# Altium project GolgiBot_V2.02_Cabos.PrjPcb
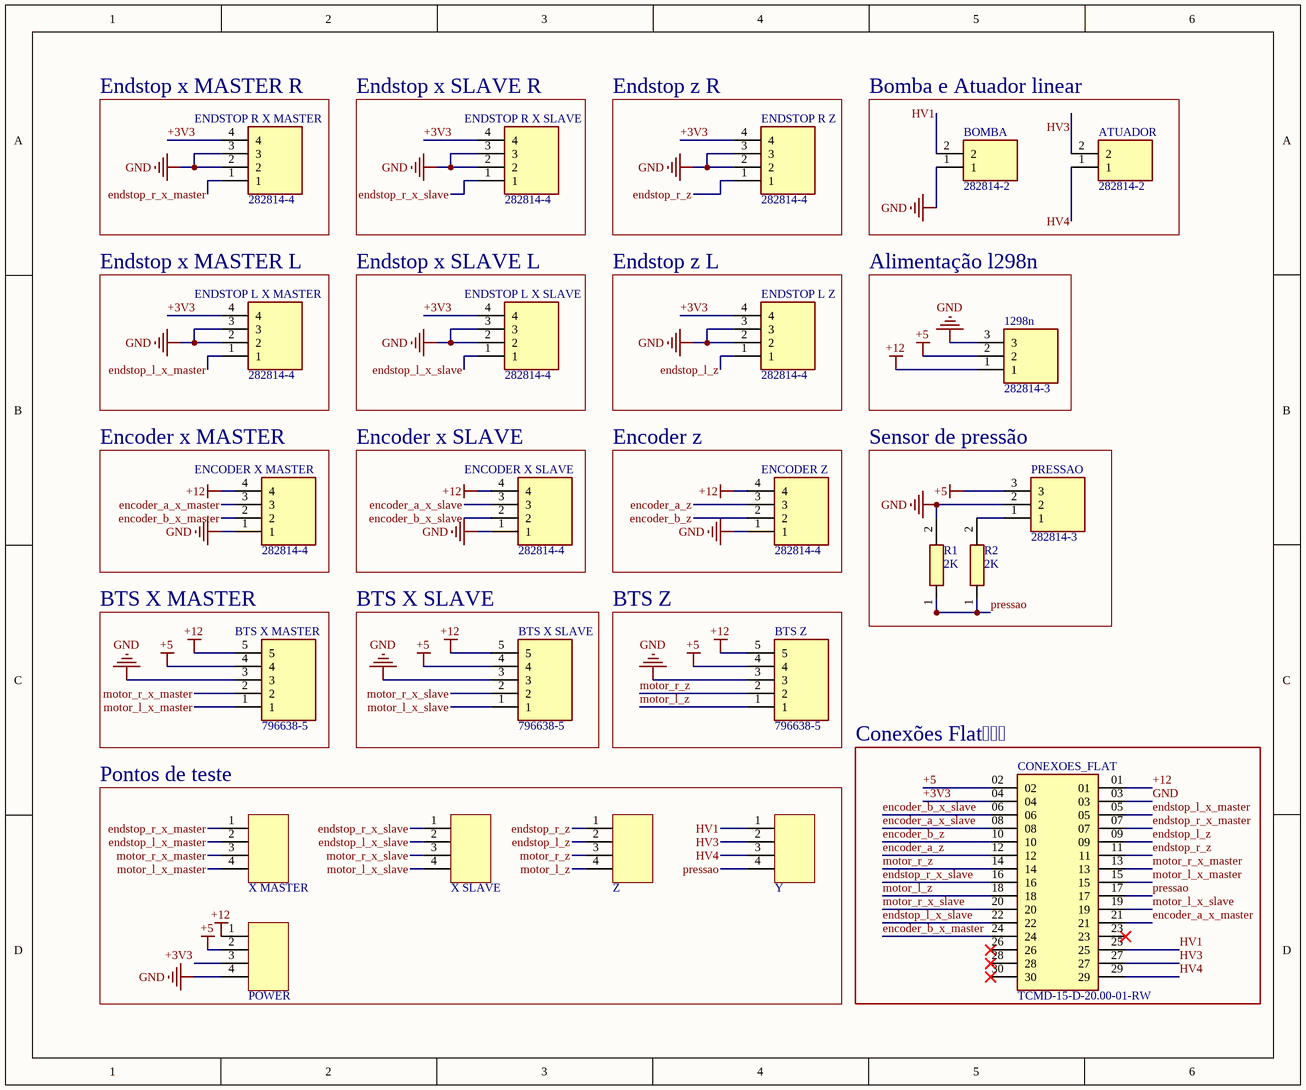
[diagram p0: GolgiBot_V2.02_Cabos.SchDoc]
1 sheet, 24 parts. Net scope: global (net labels, ports and power ports of the same name join across sheets).
Board file: GolgiBot_V2.02_Cabos.PcbDoc

## Sheet GolgiBot_V2.02_Cabos.SchDoc
size 243 x 203 mm; SheetNumber: 1; SheetTotal: 1

### Parts
1298n  282814-3  [TE_282814-3]
ATUADOR  282814-2  [TE_282814-2]
BOMBA  282814-2  [TE_282814-2]
BTS_X_MASTER  796638-5  [TE_796638-5]
BTS_X_SLAVE  796638-5  [TE_796638-5]
BTS_Z  796638-5  [TE_796638-5]
CONEXOES_FLAT  TCMD-15-D-20.00-01-RW  [SAMTEC_TCMD-15-D-20.00-01-RW]
ENCODER_X_MASTER  282814-4  [2828144]
ENCODER_X_SLAVE  282814-4  [2828144]
ENCODER_Z  282814-4  [2828144]
ENDSTOP_L_X_MASTER  282814-4  [2828144]
ENDSTOP_L_X_SLAVE  282814-4  [2828144]
ENDSTOP_L_Z  282814-4  [2828144]
ENDSTOP_R_X_MASTER  282814-4  [2828144]
ENDSTOP_R_X_SLAVE  282814-4  [2828144]
ENDSTOP_R_Z  282814-4  [2828144]
POWER  Testing PADS 1x4  [Testing PADS 1x4]  (value not drawn)
PRESSAO  282814-3  [TE_282814-3]
R1  2K  [RESC1608X55N]
R2  2K  [RESC1608X55N]
X_MASTER  Testing PADS 1x4  [Testing PADS 1x4]  (value not drawn)
X_SLAVE  Testing PADS 1x4  [Testing PADS 1x4]  (value not drawn)
Y  Testing PADS 1x4  [Testing PADS 1x4]  (value not drawn)
Z  Testing PADS 1x4  [Testing PADS 1x4]  (value not drawn)

### Blocks framed on the sheet
Endstop x MASTER R: ENDSTOP_R_X_MASTER
Endstop x SLAVE R: ENDSTOP_R_X_SLAVE
Endstop z R: ENDSTOP_R_Z
Bomba e Atuador linear: ATUADOR BOMBA
Endstop x MASTER L: ENDSTOP_L_X_MASTER
Endstop x SLAVE L: ENDSTOP_L_X_SLAVE
Endstop z L: ENDSTOP_L_Z
Alimentação l298n: 1298n
Encoder x MASTER: ENCODER_X_MASTER
Encoder x SLAVE: ENCODER_X_SLAVE
Encoder z: ENCODER_Z
Sensor de pressão: PRESSAO R1 R2
BTS X MASTER: BTS_X_MASTER
BTS X SLAVE: BTS_X_SLAVE
BTS Z: BTS_Z
Pontos de teste: POWER X_MASTER X_SLAVE Y Z
Conexões Flat: CONEXOES_FLAT

### Nets
+5: 1298n.2 BTS_X_MASTER.4 BTS_X_SLAVE.4 BTS_Z.4 CONEXOES_FLAT.02 POWER.2 PRESSAO.3
+12: 1298n.1 BTS_X_MASTER.5 BTS_X_SLAVE.5 BTS_Z.5 CONEXOES_FLAT.01 ENCODER_X_MASTER.4 ENCODER_X_SLAVE.4 ENCODER_Z.4 POWER.1
GND: 1298n.3 BOMBA.1 BTS_X_MASTER.3 BTS_X_SLAVE.3 BTS_Z.3 CONEXOES_FLAT.03 ENCODER_X_MASTER.1 ENCODER_X_SLAVE.1 ENCODER_Z.1 ENDSTOP_L_X_MASTER.2 ENDSTOP_L_X_MASTER.3 ENDSTOP_L_X_SLAVE.2 ENDSTOP_L_X_SLAVE.3 ENDSTOP_L_Z.2 ENDSTOP_L_Z.3 ENDSTOP_R_X_MASTER.2 ENDSTOP_R_X_MASTER.3 ENDSTOP_R_X_SLAVE.2 ENDSTOP_R_X_SLAVE.3 ENDSTOP_R_Z.2 ENDSTOP_R_Z.3 POWER.4 PRESSAO.2 R1.2
+3V3: CONEXOES_FLAT.04 ENDSTOP_L_X_MASTER.4 ENDSTOP_L_X_SLAVE.4 ENDSTOP_L_Z.4 ENDSTOP_R_X_MASTER.4 ENDSTOP_R_X_SLAVE.4 ENDSTOP_R_Z.4 POWER.3
encoder_a_x_master: CONEXOES_FLAT.21 ENCODER_X_MASTER.3
encoder_a_x_slave: CONEXOES_FLAT.08 ENCODER_X_SLAVE.3
encoder_a_z: CONEXOES_FLAT.12 ENCODER_Z.3
encoder_b_x_master: CONEXOES_FLAT.24 ENCODER_X_MASTER.2
encoder_b_x_slave: CONEXOES_FLAT.06 ENCODER_X_SLAVE.2
encoder_b_z: CONEXOES_FLAT.10 ENCODER_Z.2
endstop_l_x_master: CONEXOES_FLAT.05 ENDSTOP_L_X_MASTER.1 X_MASTER.2
endstop_l_x_slave: CONEXOES_FLAT.22 ENDSTOP_L_X_SLAVE.1 X_SLAVE.2
endstop_l_z: CONEXOES_FLAT.09 ENDSTOP_L_Z.1 Z.2
endstop_r_x_master: CONEXOES_FLAT.07 ENDSTOP_R_X_MASTER.1 X_MASTER.1
endstop_r_x_slave: CONEXOES_FLAT.16 ENDSTOP_R_X_SLAVE.1 X_SLAVE.1
endstop_r_z: CONEXOES_FLAT.11 ENDSTOP_R_Z.1 Z.1
HV1: BOMBA.2 CONEXOES_FLAT.25 Y.1
HV3: ATUADOR.2 CONEXOES_FLAT.27 Y.2
HV4: ATUADOR.1 CONEXOES_FLAT.29 Y.3
motor_l_x_master: BTS_X_MASTER.1 CONEXOES_FLAT.15 X_MASTER.4
motor_l_x_slave: BTS_X_SLAVE.1 CONEXOES_FLAT.19 X_SLAVE.4
motor_l_z: BTS_Z.1 CONEXOES_FLAT.18 Z.4
motor_r_x_master: BTS_X_MASTER.2 CONEXOES_FLAT.13 X_MASTER.3
motor_r_x_slave: BTS_X_SLAVE.2 CONEXOES_FLAT.20 X_SLAVE.3
motor_r_z: BTS_Z.2 CONEXOES_FLAT.14 Z.3
pressao: CONEXOES_FLAT.17 R1.1 R2.1 Y.4
NetPRESSAO_1: PRESSAO.1 R2.2

Not connected (* = marked no-connect by the designer): CONEXOES_FLAT 23* 26* 28* 30*

### Library data of the parts
1298n PRESSAO = 282814-3: TERMI-BLOK HEADER,ASSY90 3P.5; Number_of_Positions: 3; MF: TE Connectivity; Centerline_Pitch: 5.08 mm[.2 in]; Value: *; MP: 282814-3; EU_RoHS_Compliance: Compliant; Package: None; TE_purchase_URL: https://www.te.com/usa-en/product-282814-3.html?te_bu=Cor&te_type=disp&te_campaign=seda_glo_cor-seda-global-disp-prtnr-fy19-seda-model-bom-cta_sma-317_1&elqCampaignId=32493; SnapEDA_Link: https://www.snapeda.com/parts/282814-3/TE%20Connectivity%20AMP%20Connectors/view-part/970102/?ref=snap; Availability: Unavailable; Price: None
ATUADOR BOMBA = 282814-2: TERMI-BLOK HEADER,ASSY90 3P.5; Package: None; Availability: Unavailable; Value: *; MP: 282814-2; Price: None
BTS_X_MASTER BTS_X_SLAVE BTS_Z = 796638-5: 5 Position Terminal Block Header, Male Pins, Shrouded (4 Side) 0.200 (5.08mm) 90Â°, Right Angle Through Hole; MF: TE Connectivity; Centerline_Pitch: 5.08 mm[.2 in]; Number_of_Positions: 5; SnapEDA_Link: https://www.snapeda.com/parts/796638-5/TE%20Connectivity%20AMP%20Connectors/view-part/275803/?ref=snap; Check_prices: https://www.snapeda.com/parts/796638-5/TE%20Connectivity%20AMP%20Connectors/view-part/275803/?ref=eda; Availability: Good; MP: 796638-5; Package: None; Purchase-URL: https://pricing.snapeda.com/search/part/796638-5/?ref=eda; Price: None; Value: *; EU_RoHS_Compliance: Compliant
CONEXOES_FLAT = TCMD-15-D-20.00-01-RW: TCMD Series 2.00 mm IDC Ribbon Cable Assembly, Terminal; MF: Samtec; SnapEDA_Link: https://www.snapeda.com/parts/TCMD-15-D-20.00-01-RW/Samtec/view-part/?ref=snap; Package: None; Value: *; MP: TCMD-15-D-20.00-01-RW; Check_prices: https://www.snapeda.com/parts/TCMD-15-D-20.00-01-RW/Samtec/view-part/?ref=eda
ENCODER_X_MASTER ENCODER_X_SLAVE ENCODER_Z ENDSTOP_L_X_MASTER ENDSTOP_L_X_SLAVE ENDSTOP_L_Z ENDSTOP_R_X_MASTER ENDSTOP_R_X_SLAVE ENDSTOP_R_Z = 282814-4: Connector; Manufacturer_Name: TE Connectivity; Datasheet Link: https://www.te.com/commerce/DocumentDelivery/DDEController?Action=showdoc&DocId=Customer+Drawing%7F282814%7FC1%7Fpdf%7FEnglish%7FENG_CD_282814_C1.pdf%7F282814-4; Height: 8.5mm; Manufacturer_Part_Number: 282814-4; Mouser Part Number: 571-282814-4; Mouser Price/Stock: https://www.mouser.co.uk/ProductDetail/TE-Connectivity/282814-4?qs=79%2FjLZ2kXkrgi3RIXIXGaA%3D%3D; Arrow Part Number: 282814-4; Arrow Price/Stock: https://www.arrow.com/en/products/282814-4/te-connectivity?region=nac
POWER X_MASTER X_SLAVE Y Z = Testing PADS 1x4: Headers & Wire Housings 40Pin 2mm Spacing Single Row Hdrs, 5pc; Manufacturer: Cromax; Mounting Angle: Vertical; Number of Positions: 40 Position; Supplier 1: -; Manufacturer Part Number: -; RoHS: RoHS Compliant; Category: Headers & Wire Housings; Stock 1: 14; Pricing 1: 1=1.60, 2=0.80 (BRL); Accessory Type: -; Contact Plating: Gold; Contact Type: -; Number of Rows: 1 Row; Product: Headers; Termination Style: Through Hole; Type: Breakaway; Brand: Cromax; Mounting Style: Straight Pin; Pitch: 2 mm; Row Spacing: -; Contact Gender: Pin (Female); Product Category: Accessories; RoHS - Mouser: Y; Minimum Order Quantity: 1; Reeling: False; ComponentLink1URL: -; ComponentLink1Description: -; Supplier Part Number 1: -
R1 R2 = ERJ-3EKF1001V: Resistor; Manufacturer_Name: Panasonic; Datasheet Link: http://industrial.panasonic.com/cdbs/www-data/pdf/RDA0000/AOA0000C86.pdf; Height: 0.55mm; Manufacturer_Part_Number: ERJ-3EKF1001V; Mouser Part Number: 667-ERJ-3EKF1001V; Mouser Price/Stock: https://www.mouser.co.uk/ProductDetail/Panasonic/ERJ-3EKF1001V?qs=H7k1u0Mp9JTM8yQxOuvoDg%3D%3D; Arrow Part Number: ERJ-3EKF1001V; Arrow Price/Stock: https://www.arrow.com/en/products/erj-3ekf1001v/panasonic?region=nac